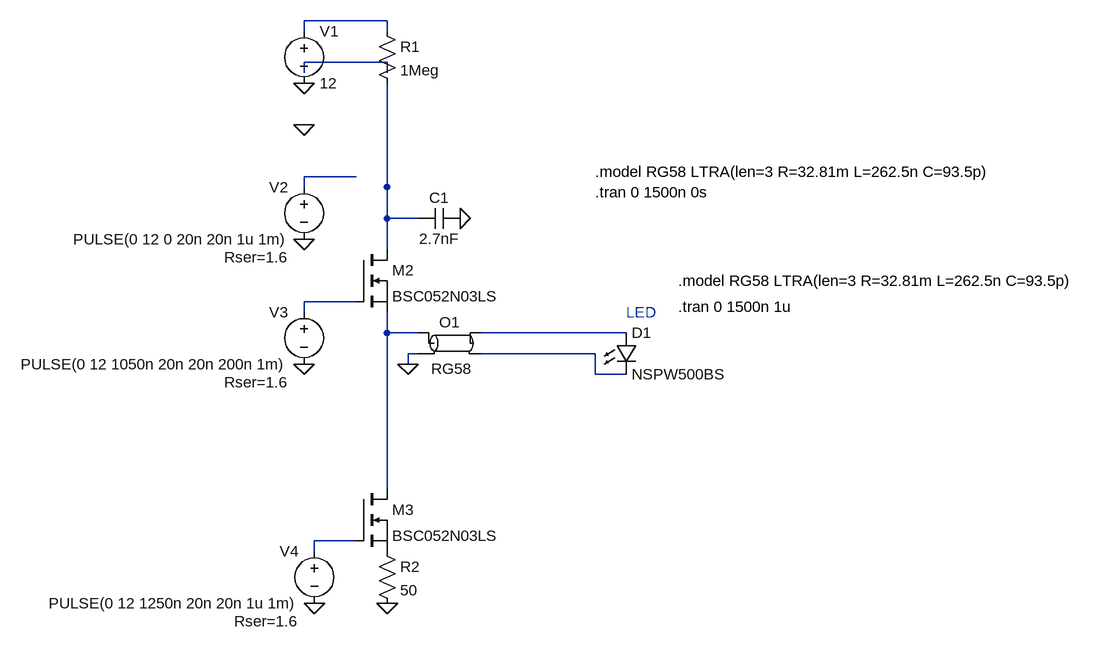
[diagram p0: schematic LEDpulser.asc]
LEDpulser.asc, the LTspice schematic file:
Version 4
SHEET 1 1316 680
<<<<<<< HEAD
WIRE 208 -272 80 -272
WIRE 80 -256 80 -272
WIRE 208 -256 208 -272
WIRE 208 -112 208 -176
WIRE 160 -32 80 -32
WIRE 80 -16 80 -32
WIRE 208 32 208 -16
=======
WIRE 208 -208 80 -208
WIRE 80 -192 80 -208
WIRE 208 -192 208 -208
WIRE 208 32 208 -112
>>>>>>> 5c4516cbc75145b25915ce3b70d8ea61b5ad7dbc
WIRE 256 32 208 32
WIRE 208 80 208 32
WIRE 160 160 80 160
WIRE 80 176 80 160
WIRE 208 208 208 176
WIRE 256 208 208 208
WIRE 576 208 352 208
WIRE 256 240 240 240
WIRE 528 240 352 240
WIRE 240 256 240 240
WIRE 528 272 528 240
WIRE 576 272 528 272
WIRE 208 448 208 208
WIRE 160 528 96 528
WIRE 96 544 96 528
FLAG 240 256 0
<<<<<<< HEAD
FLAG 80 -176 0
FLAG 80 64 0
=======
FLAG 80 -112 0
>>>>>>> 5c4516cbc75145b25915ce3b70d8ea61b5ad7dbc
FLAG 80 256 0
FLAG 320 32 0
FLAG 208 624 0
FLAG 96 624 0
SYMBOL ltline 304 224 R0
WINDOW 3 3 24 Top 2
SYMATTR Value RG58
SYMATTR InstName O1
SYMBOL LED 560 208 R0
SYMATTR InstName D1
SYMATTR Value NSPW500BS
SYMATTR Description Diode
SYMATTR Type diode
SYMBOL voltage 80 -272 R0
WINDOW 123 0 0 Left 0
WINDOW 39 0 0 Left 0
SYMATTR InstName V1
SYMATTR Value 12
<<<<<<< HEAD
SYMBOL voltage 80 -32 M0
WINDOW 123 0 0 Left 0
WINDOW 39 24 124 Left 2
SYMATTR SpiceLine Rser=1.6
SYMATTR InstName V2
SYMATTR Value PULSE(0 12 0 20n 20n 1u 1m)
=======
>>>>>>> 5c4516cbc75145b25915ce3b70d8ea61b5ad7dbc
SYMBOL voltage 80 160 M0
WINDOW 123 0 0 Left 0
WINDOW 39 24 124 Left 2
SYMATTR SpiceLine Rser=1.6
SYMATTR InstName V3
SYMATTR Value PULSE(0 12 1050n 20n 20n 200n 1m)
SYMBOL cap 320 16 R90
WINDOW 0 0 32 VBottom 2
WINDOW 3 32 32 VTop 2
SYMATTR InstName C1
SYMATTR Value 2.7nF
SYMATTR SpiceLine V=630 Irms=0 Rser=0 Lser=0 mfg="Murata" pn="GCM31A5C2J271JX01" type="C0G"
SYMBOL nmos 160 80 R0
SYMATTR InstName M2
SYMATTR Value BSC052N03LS
SYMBOL res 192 -272 R0
SYMATTR InstName R1
SYMATTR Value 1Meg
SYMBOL nmos 160 448 R0
SYMATTR InstName M3
SYMATTR Value BSC052N03LS
SYMBOL res 192 528 R0
SYMATTR InstName R2
SYMATTR Value 50
SYMBOL voltage 96 528 M0
WINDOW 123 0 0 Left 0
WINDOW 39 24 124 Left 2
SYMATTR SpiceLine Rser=1.6
SYMATTR InstName V4
<<<<<<< HEAD
SYMATTR Value PULSE(0 12 1300n 20n 20n 150n 1m)
TEXT 528 -40 Left 2 !.model RG58 LTRA(len=3 R=32.81m L=262.5n C=93.5p)
TEXT 528 -8 Left 2 !.tran 0 1500n 0s
TEXT 576 176 Left 2 ;LED
=======
SYMATTR Value PULSE(0 12 1250n 20n 20n 1u 1m)
TEXT 656 128 Left 2 !.model RG58 LTRA(len=3 R=32.81m L=262.5n C=93.5p)
TEXT 656 168 Left 2 !.tran 0 1500n 1u
>>>>>>> 5c4516cbc75145b25915ce3b70d8ea61b5ad7dbc

The netlist it stands for:
* LEDpulser.asc
O1 N006 0 N007 N008 RG58
D1 N007 N008 NSPW500BS
V1 N001 0 12
V2 N003 0 PULSE(0 12 0 20n 20n 1u 1m) Rser=1.6
V3 N005 0 PULSE(0 12 1050n 20n 20n 200n 1m) Rser=1.6
C1 0 N002 2.7nF V=630 Irms=0 Rser=0 Lser=0 mfg="Murata" pn="GCM31A5C2J271JX01" type="C0G"
M2 N002 N005 N006 N006 BSC052N03LS
R1 N001 N002 1Meg
M3 N006 N009 P001 P001 BSC052N03LS
R2 P001 0 50
V4 N009 0 PULSE(0 12 1250n 20n 20n 1u 1m) Rser=1.6
.model D D
.lib standard.dio
.model NMOS NMOS
.model PMOS PMOS
.lib standard.mos
.model RG58 LTRA(len=3 R=32.81m L=262.5n C=93.5p)
.tran 0 1500n 0s
* LED
.model RG58 LTRA(len=3 R=32.81m L=262.5n C=93.5p)
.tran 0 1500n 1u
.backanno
.end